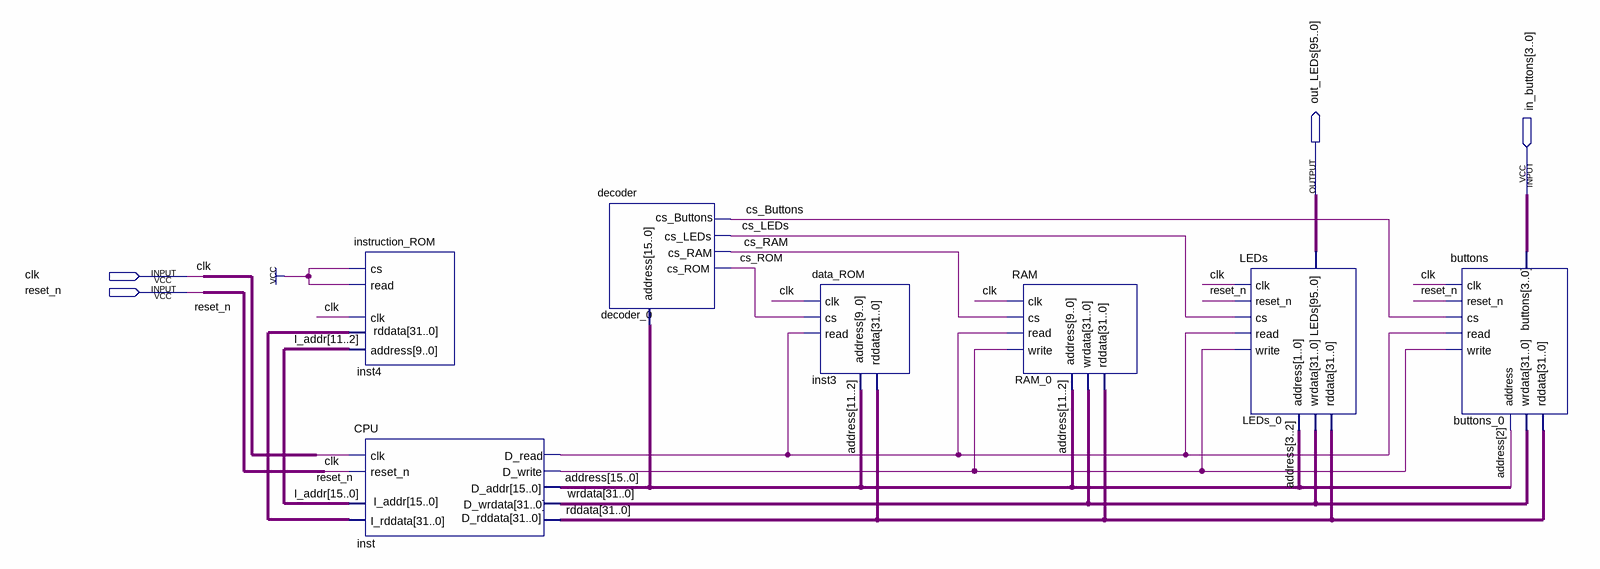
[diagram p0: schematic sheet]
// Quartus schematic GECKO.bdf as structural Verilog: 7 symbols, 4 pins
module GECKO (
  input  [3:0] in_buttons,
  input  clk,
  input  reset_n,
  output [95:0] out_LEDs
);

  wire cs_Buttons, cs_LEDs, cs_RAM, cs_ROM, inst_d_read, inst_d_write;
  wire [15:0] address, I_addr;
  wire [31:0] inst4_rddata, rddata, wrdata;

  instruction_ROM inst4 (.clk(clk), .cs(1'b1), .read(1'b1), .address(I_addr[11:2]), .rddata(inst4_rddata));
  CPU inst (
    .I_rddata(inst4_rddata), .D_rddata(rddata), .clk(clk), .reset_n(reset_n), .D_wrdata(wrdata),
    .D_addr(address), .D_read(inst_d_read), .D_write(inst_d_write), .I_addr(I_addr));
  decoder decoder_0 (.address(address), .cs_RAM(cs_RAM), .cs_ROM(cs_ROM), .cs_Buttons(cs_Buttons), .cs_LEDs(cs_LEDs));
  data_ROM inst3 (.clk(clk), .cs(cs_ROM), .read(inst_d_read), .address(address[11:2]), .rddata(rddata));
  RAM RAM_0 (
    .clk(clk), .cs(cs_RAM), .write(inst_d_write), .wrdata(wrdata), .read(inst_d_read),
    .address(address[11:2]), .rddata(rddata));
  LEDs LEDs_0 (
    .clk(clk), .reset_n(reset_n), .cs(cs_LEDs), .write(inst_d_write), .address(address[3:2]),
    .wrdata(wrdata), .read(inst_d_read), .rddata(rddata), .LEDs(out_LEDs));
  buttons buttons_0 (
    .clk(clk), .reset_n(reset_n), .cs(cs_Buttons), .read(inst_d_read), .write(inst_d_write),
    .address(address[2]), .wrdata(wrdata), .buttons(in_buttons), .rddata(rddata));
endmodule
